# EAGLE design Adafruit ESP8266 Feather (EAGLE 6.4)
COMPANY: ADAFRUIT INDUSTRIES; DRAWN: KTOWN; REV: B
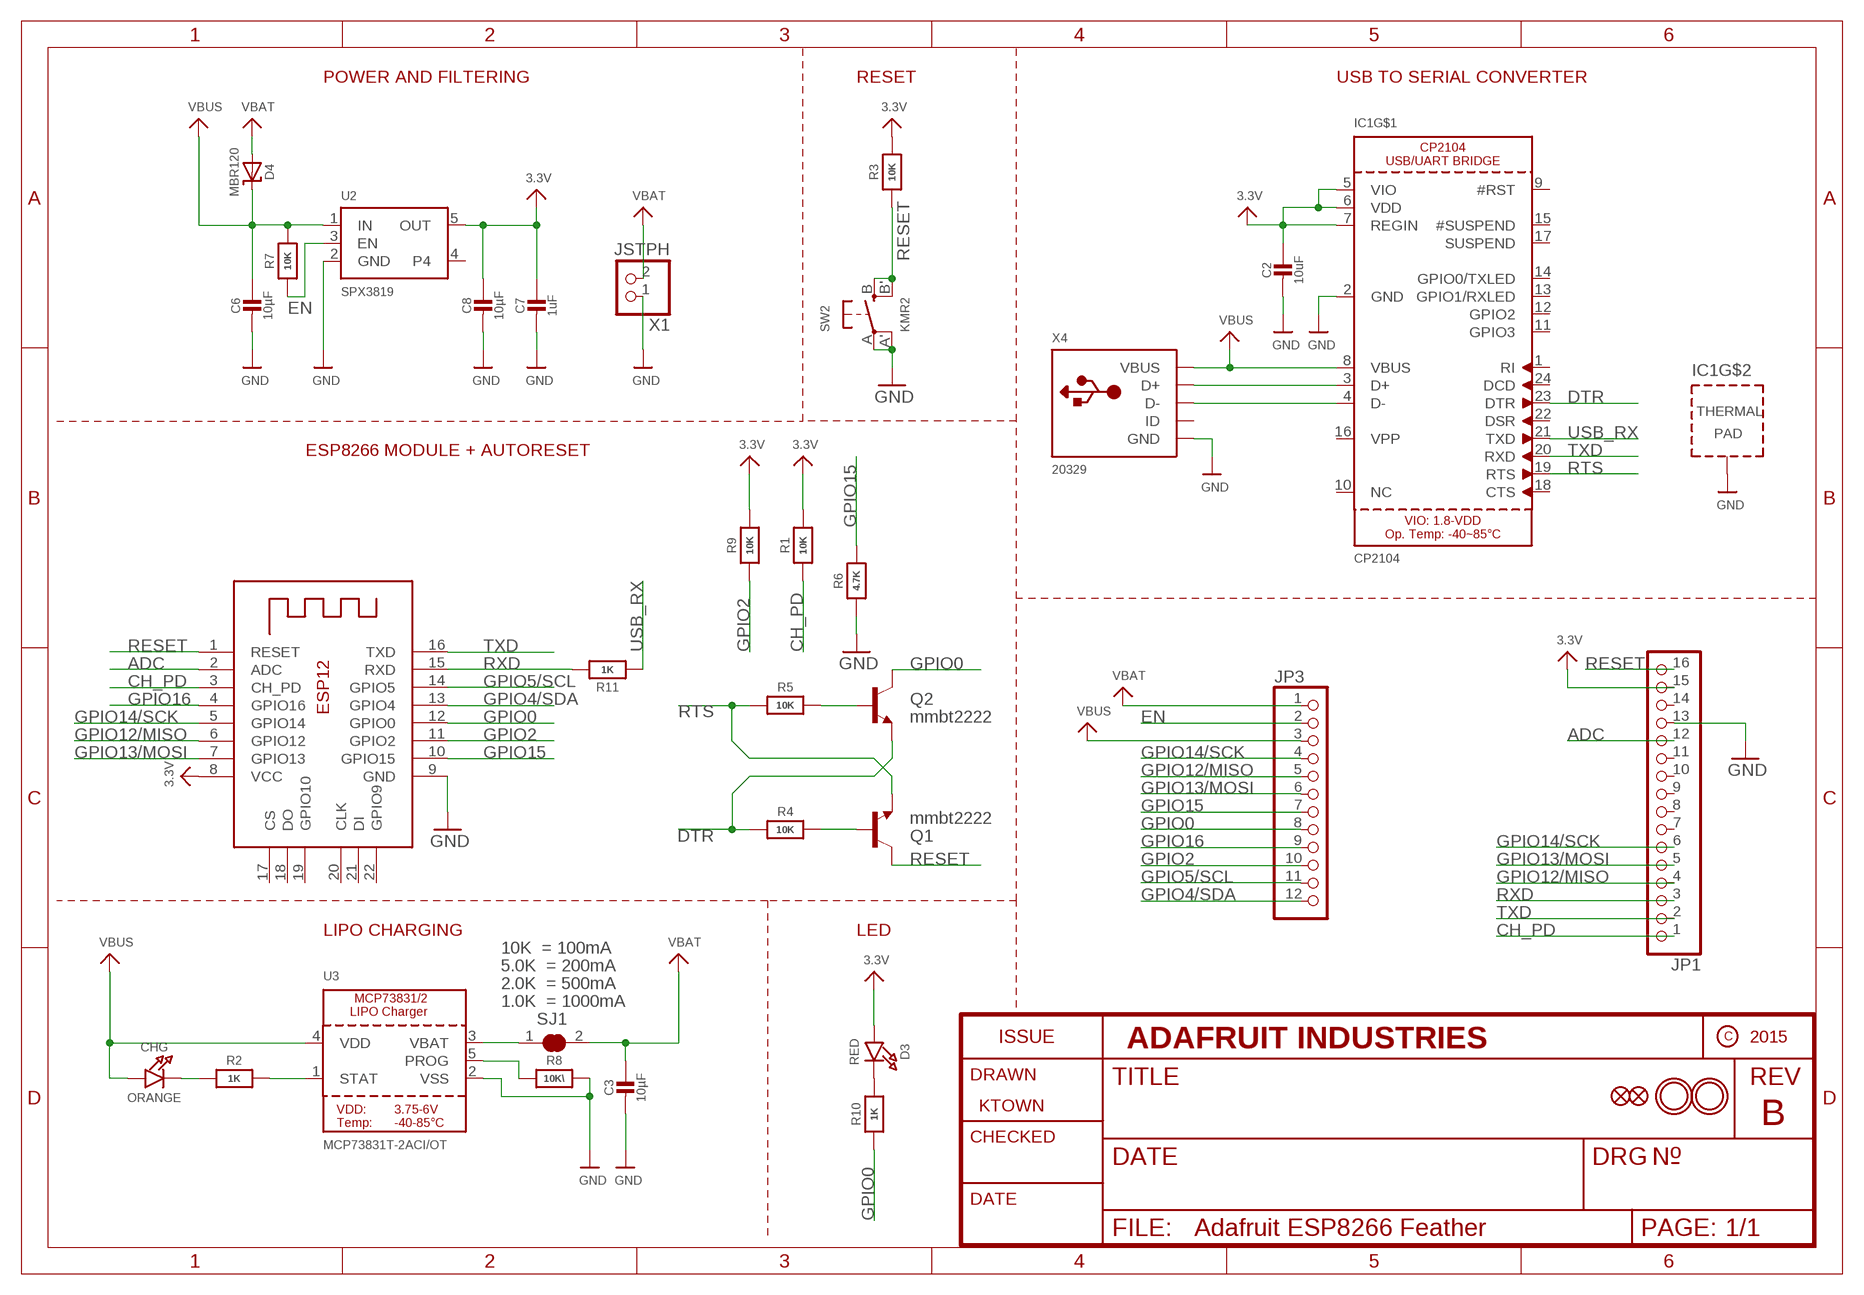
[diagram p0: schematic, sheet 1]

## Parts
C2  10uF  CAP_CERAMIC0805-NOOUTLINE  [0805-NO]
C3  10µF  CAP_CERAMIC0805-NOOUTLINE  [0805-NO]
C6  10µF  CAP_CERAMIC0805-NOOUTLINE  [0805-NO]
C7  1uF  CAP_CERAMIC0603_NO  [0603-NO]
C8  10µF  CAP_CERAMIC0805-NOOUTLINE  [0805-NO]
CHG  ORANGE  LED0805_NOOUTLINE  [CHIPLED_0805_NOOUTLINE]
D3  RED  LED0805_NOOUTLINE  [CHIPLED_0805_NOOUTLINE]
D4  MBR120  DIODE-SCHOTTKYSOD-123  [SOD-123]
IC1  CP2104  [QFN24_4MM_SMSC]
JP1  HEADER-1X16ROUND  [1X16_ROUND]
JP3  HEADER-1X12  [1X12_ROUND]
Q1  mmbt2222  TRANSISTOR_NPNSOT23-3  [SOT23-3]
Q2  mmbt2222  TRANSISTOR_NPNSOT23-3  [SOT23-3]
R1  10K  RESISTOR_0603_NOOUT  [0603-NO]
R2  1K  RESISTOR_0603_NOOUT  [0603-NO]
R3  10K  RESISTOR_0603_NOOUT  [0603-NO]
R4  10K  RESISTOR_0603_NOOUT  [0603-NO]
R5  10K  RESISTOR_0603MP  [_0603MP]
R6  4.7K  RESISTOR_0603_NOOUT  [0603-NO]
R7  10K  RESISTOR_0603_NOOUT  [0603-NO]
R8  10K\  RESISTOR_0603_NOOUT  [0603-NO]
R9  10K  RESISTOR_0603_NOOUT  [0603-NO]
R10  1K  RESISTOR_0603_NOOUT  [0603-NO]
R11  1K  RESISTOR_0603MP  [_0603MP]
SJ1  SOLDERJUMPER_CLOSED  [SOLDERJUMPER_CLOSEDWIRE]
SW2  KMR2  SWITCH_TACT_SMT4.6X2.8  [BTN_KMR2_4.6X2.8]
U2  SPX3819  VREG_SOT23-5  [SOT23-5]
U3  MCP73831T-2ACI/OT  MCP73831/2  [SOT23-5]
U$31  MOUNTINGHOLE2.5  [MOUNTINGHOLE_2.5_PLATED]
U$32  MOUNTINGHOLE2.5  [MOUNTINGHOLE_2.5_PLATED]
U$34  FIDUCIAL""  [FIDUCIAL_1MM]
U$35  FIDUCIAL""  [FIDUCIAL_1MM]
X1  JSTPH  CON_JST_PH_2PIN  [JSTPH2]
X2  ESP-12  ESP-12E  [ESP-12E]
X4  20329  USB_MICRO_20329_V2  [4UCONN_20329_V2]

## Nets
3.3V: C2.1 C7.1 C8.1 D3.A IC1.5(VIO) IC1.6(VDD) IC1.7(REGIN) JP1.15 R1.2 R3.2 R9.2 U2.5(OUT) X2.8(VCC)
ADC: JP1.12 X2.2(ADC)
CH_PD: JP1.1 R1.1 X2.3(CH_PD)
DTR: IC1.23(DTR) Q2.2(E) R4.1
EN: JP3.2 R7.1 U2.3(EN)
GND: C2.2 C3.2 C6.2 C7.2 C8.2 IC1.2(GND) IC1.THERM(TP) JP1.13 R6.1 R8.2 SW2.A'(P1) SW2.A(P) U2.2(GND) U3.2(VSS) X1.1 X2.9(GND) X4.BASE@1(GND) X4.BASE@2(GND) X4.GND X4.SPRT@1(GND) X4.SPRT@2(GND) X4.SPRT@3(GND) X4.SPRT@4(GND)
GPIO0: JP3.8 Q2.3(C) R10.1 X2.12(GPIO0)
GPIO2: JP3.10 R9.1 X2.11(GPIO2)
GPIO4/SDA: JP3.12 X2.13(GPIO4)
GPIO5/SCL: JP3.11 X2.14(GPIO5)
GPIO12/MISO: JP1.4 JP3.5 X2.6(GPIO12)
GPIO13/MOSI: JP1.5 JP3.6 X2.7(GPIO13)
GPIO14/SCK: JP1.6 JP3.4 X2.5(GPIO14)
GPIO15: JP3.7 R6.2 X2.10(GPIO15)
GPIO16: JP3.9 X2.4(GPIO16)
N$1: CHG.C R2.1
N$2: IC1.3(D+) X4.D+
N$3: R2.2 U3.1(STAT)
N$4: R8.1 U3.5(PROG)
N$5: D3.C R10.2
N$6: IC1.4(D-) X4.D-
N$7: SJ1.1 U3.3(VBAT)
N$12: Q1.1(B) R4.2
N$13: Q2.1(B) R5.2
RESET: JP1.16 Q1.3(C) R3.1 SW2.B'(S1) SW2.B(S) X2.1(RESET)
RTS: IC1.19(RTS) Q1.2(E) R5.1
RXD: JP1.3 R11.2 X2.15(RXD)
TXD: IC1.20(RXD) JP1.2 X2.16(TXD)
USB_RX: IC1.21(TXD) R11.1
VBAT: C3.1 D4.A JP3.1 SJ1.2 X1.2
VBUS: C6.1 CHG.A D4.C IC1.8(VBUS) JP3.3 R7.2 U2.1(IN) U3.4(VDD) X4.VBUS
Unconnected: IC1.1(RI) IC1.9(#RST) IC1.10(NC) IC1.11(GPIO3) IC1.12(GPIO2) IC1.13(GPIO1/RXLED) IC1.14(GPIO0/TXLED) IC1.15(#SUSPEND) IC1.16(VPP) IC1.17(SUSPEND) IC1.18(CTS) IC1.22(DSR) IC1.24(DCD) JP1.7 JP1.8 JP1.9 JP1.10 JP1.11 JP1.14 U2.4 X2.17(CS) X2.18(DO) X2.19(GPIO10) X2.20(CLK) X2.21(DI) X2.22(GPIO9) X4.ID

## Notes on the sheet
- POWER AND FILTERING | RESET | USB TO SERIAL CONVERTER
- ESP8266 MODULE + AUTORESET
- LIPO CHARGING | LED
- 10K  = 100mA
- 5.0K  = 200mA
- 2.0K  = 500mA
- 1.0K  = 1000mA

## Library data of the parts
C2 C3 C6-C8 = microbuilder:CAP_CERAMIC: Ceramic Capacitors For new designs, use the packages preceded by an '_' character since they are more reliable: The following footprints should be used on most boards: _0402 - Standard footprint for regular board layouts _0603 - Standard footprint for regular board layouts _0805 - Standard footprint for regular board layouts _1206 - Standard footprint for regular board layouts For extremely tight-pitch boards where space is at a premium, the following 'micro-pitch' footprints can be used (smaller pads, no silkscreen outline, etc.): _0402MP - Micro-pitch footprint for very dense/compact boards _0603MP - Micro-pitch footprint for very dense/compact boards _0805MP - Micro-pitch footprint for very dense/compact boards _1206MP - Micro-pitch footprint for very dense/compact boards
CHG D3 = microbuilder:LED: LED 0603 - 0603 Surface Mount Package 2mA: Green LED - Low Power (3.9mcd, 2ma, 1.7Vf) - Digikey: 475-2709-2-ND Orange LED - Low Power (9.8mcd, 2ma, 1.8Vf) - Digikey: 475-1194-2-ND Red LED - Low Power (5mcd, 2ma, 1.8Vf) - Digikey: 475-1195-2-ND Yellow LED - Low Power (7mcd, 2ma, 1.8Vf) - Digikey: 475-1196-2-ND 5mA: Blue LED - Low Power (17mcd, 5ma, 2.9Vf) - Digikey: LNJ937W8CRACT-ND 0805 - 0805 Surface Mount Package 2mA: Red LED (8.8mcd, 2mA, 1.8Vf, Clear) - Low Power [Digikey: 475-2510-1-ND] Green LED (5mcd, 2mA, 1.8Vf, Clear) - Low Power [Digikey: 475-2730-1-ND] Yellow LED (11.3mcd, 2mA, 1.8Vf, Clear) - Low Power [Digikey: 475-2555-1-ND] 20mA: Red LED (104mcd, 20mA, Diffused) - LS R976 [Digikey: 475-1278-6-ND] Red LED (12mcd, 20mA, 2.0Vf, Clear) - APT2012EC [Digikey: 754-1128-1-ND] Green LED (15mcd, 20mA, 2.2Vf, Clear) - APT2012GC [Digikey: 754-1131-1-ND] Orange LED (160mcd, 20mA, 2.1Vf, Clear) - APT2012SECK [Digikey: 754-1130-1-ND] 1206 - 1206 Surface Mount Package Green LED (26mcd, 20mA, Diffused) - LG N971 [Digikey: 475-1407-6-ND] Red LED (15mcd, 20mA, Diffused) - LH N974 [Digikey: 475-1416-6-ND] Cree - Cree High-Power Surface Mount LEDs XPEBWT-L1-0000-00D50 - White 111lm 350mA 2.9Vf 6200K 110° XTEAWT-00-0000-00000LEE3 - White 114lm 350mA 2.85Vf 5000K 115° Everlight - Everlight 45-21 Series Surface Mount LEDs 45-21/QK2C-B2832AC2CB2/2T - Warm White 2000mcd 20mA 3.25Vf 3050K 120° 45-21/LK2C-B38452C4CB2/2T - Nuetral White 2000mcd 20mA 3.25Vf 4150K 120° 45-21/LK2C-B50634C6CB2/2T - Cold White 2200mcd 20mA 3.25Vf 5650K 120° PLCC2 Reverse Mount LS T77K-J1L2-1-0-2-R18-Z - Red 11.25mcd 2mA 1.8Vf 630nm 120° LO T77K-L1M2-24-Z - Orange 19.6mcd 2mA 1.8Vf 606nm 120° LY T77K-K2M1-26-Z - Yellow 15.7mcd 2mA 1.8Vf 587nm 120°
D4 = microbuilder:DIODE-SCHOTTKY
IC1 = microbuilder:CP2104: CP2104 - USB to UART Bridge VDD Output: 3.45V
JP1 = microbuilder:HEADER-1X16: PIN HEADER
JP3 = microbuilder:HEADER-1X12
Q1 Q2 = SparkFun:TRANSISTOR_NPN: Transistor NPN BJT configuration in SOT23 package. MMBT2222 is the common NPN we use. Double check BCE configuration again layout.
R1-R11 = microbuilder:RESISTOR: Resistors For new designs, use the packages preceded by an '_' character since they are more reliable: The following footprints should be used on most boards: _0402 - Standard footprint for regular board layouts _0603 - Standard footprint for regular board layouts _0805 - Standard footprint for regular board layouts _1206 - Standard footprint for regular board layouts For extremely tight-pitch boards where space is at a premium, the following 'micro-pitch' footprints can be used (smaller pads, no silkscreen outline, etc.): _0402MP - Micro-pitch footprint for very dense/compact boards _0603MP - Micro-pitch footprint for very dense/compact boards _0805MP - Micro-pitch footprint for very dense/compact boards _1206MP - Micro-pitch footprint for very dense/compact boards
SJ1 = microbuilder:SOLDERJUMPER_CLOSED: Solder Jumper - Closed These solder jumpers are closed by default CLOSEDWIRE - 10 mil trace between pads that can be cut and resoldered later CLOSEDPERM - 63 mil trace between pads for a permanent connection (used to 'bridge' two signals, a shameless hack for Eagle). Can double as a test point as well (no cream layer)
SW2 = microbuilder:SWITCH_TACT_SMT: SMT Tact Switches 6x6mm - Digikey: P12940SCT-ND KMR2 (4.6x2.8mm) - Digikey: 401-1426-1-ND EVQ-PQHB55 - Light Touch, 160GF (4.5x4.5mm) - Digikey: P8090SCT-ND KMT0 - KMT021 NGJ LHS (etc.) IP68/Waterproof - Digikey: CKN10289CT-ND
U2 = microbuilder:VREG_SOT23-5: SOT23-5 Fixed Voltage Regulators Part Current Out V Out V In V Dropout θJA (°C/W) TJ (°C) Digikey Part No. ADP121 150mA 3.3V 3.4-5.5V 0.09V @ 150mA -- -- ADP121-AUJZ33R7CT-ND ADP121 150mA 3.0V 3.1-5.5V 0.09V @ 150mA -- -- ADP121-AUJZ30R7CT-ND ADP122 300mA 3.3V 3.4-5.5V 0.085V @ 300mA -- -- ADP122AUJZ-3.3-R7CT-ND ADP1712 300mA 3.3V 3.5-5.5V 0.17V @ 300mA -- -- ADP1712AUJZ-3.3-R7TR-ND AP7311 (Low Cost) 150mA 3.3V 3.5-6V 0.15V @ 150mA -- -- AP7311-33WG-7DICT-ND LD39015M18R 150mA 1.8V 1.9V-5.5V 0.08V @ 100mA -- -- 497-6977-1-ND LP2985A-33DBVR 150mA 3.3V 3.3-16V 0.28V @ 150mA 206 150 296-18479-1-ND MCP1824T-3302E/OT 300mA 3.3V 3.5V-6V 0.2V @ 300mA -- -- MCP1824T-3302E/OTCT-ND MIC5205-2.5YM5 TR 150mA 2.5V 2.7-16V 0.165V @ 150mA -- -- 576-1257-2-ND MIC5205-3.0YM5 TR 150mA 3.0V 3.2V-16V 0.165V @ 150mA -- -- 576-1258-2-ND MIC5205-3.3YM5 TR 150mA 3.3V 3.5V-16V 0.165V @ 150mA -- -- 576-1259-2-ND TPS780330220 150mA 3.3V+2.2V 3.6-5.5V 250mV Max -- -- 296-23332-1-ND TDA3663/N1,135 100mA 3.3V 3.5-45V 0.18V @ 50mA -- -- 568-5343-1-ND Max operating temp can be calculated using θJA, TJ (max junction temperature), and power in watts. Set the "Maximum Ambient Temperature" until it reaches TJ ("Max Junction Temperature"), which is the absolute limit for safe use of the regulator: Heat Sink Temperature Calculator <http://www.daycounter.com/Calculators/Heat-Sink-Temperature-Calculator.phtml> For example, With 12V source into a 3.3V LP2985 and a 30mA load, we are dissipating (12V-3.3V) * 0.03A = 0.261W. With a θJA of 206 °C/W, a TJ of 150°C, and 261mW we can safely use the chip without a heat sink up to 75°C (=147.1°C Junction Temperature).
U3 = microbuilder:MCP73831/2: MCP73831/2 LIPO Charger VDD: 3.75 - 6V Temp -40 - 85°C Programmable Charge Rate: 15-500mA NOTE: STAT is a tri-state logic output on the MCP73831 and an open-drain output on the MCP73832. SOT23-5 with 4.2V output and tri-state logic on STAT = MCP73831T-2ACI/OT
U$31 U$32 = microbuilder:MOUNTINGHOLE: Mounting Hole For #2 screws (0.086"/2.18mm width, 0.094"/2.4mm hole) use 2.5mm; BOM: EXCLUDE
U$34 U$35 = microbuilder:FIDUCIAL: Fiducial Alignment Points Various fiducial points for machine vision alignment.; BOM: EXCLUDE
X1 = microbuilder:CON_JST_PH_2PIN: JST 2-Pin Right-Angle Connector PH-Series - 4UConnector: 17311 SH-Series - 4UConnector: 07278
X2 = microbuilder:ESP-12E
X4 = microbuilder:USB: USB Connectors USBMINIB - Surface Mount Female Mini-B USB Connector 4UConnector: 06564

## Board
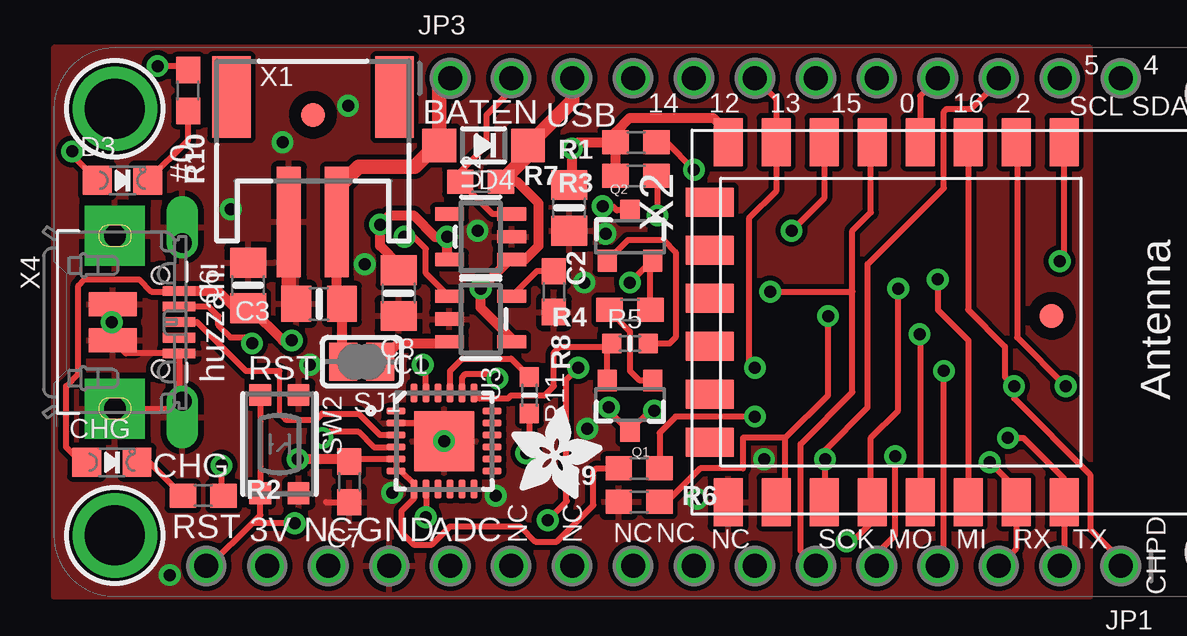
[diagram p1: board, top side]
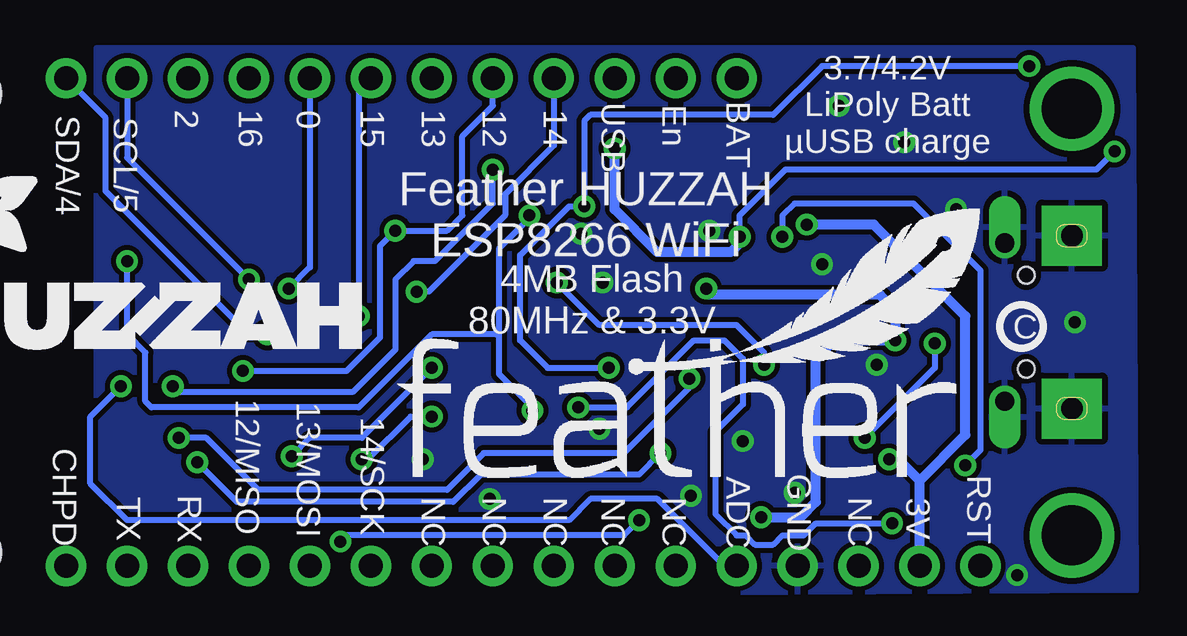
[diagram p2: board, bottom side, seen from below]

Size 1.31 x 8.1 mm. Coordinates in mm from the lower left corner, seen from the top.
Copper layers (1*16): Top 0.035mm / dielectric 1.5mm / Bottom 0.035mm
Design rules "adafruit *": minimum track width 8mil, minimum drill 15.5mil, track to track 8mil, track to pad 8mil, pad to pad 8mil, via to via 8mil, smd to smd 8mil, copper to edge 10mil, drill to drill 8mil, minimum pad ring 10mil, minimum via ring 8mil, stop-mask expansion 2mil, vias tented up to drill 20mil, thermal gap 10mil
Holes 2.2 mm at 46.37,-5.54 46.37,13.57

### Footprints (pad centres in the part's own frame; a part is rotated, then mirrored left to right if it is on the bottom)
0805-NO = smd 1.24 x 1.5: 1 -0.95,0; 2 0.95,0
0603-NO = smd 1.1 x 1: 1 -0.85,0; 2 0.85,0
CHIPLED_0805_NOOUTLINE = smd 1.2 x 1.2: A 0,-1.05; C 0,1.05
SOD-123 = smd 1.4 x 1.4: A 1.85,0; C -1.85,0
QFN24_4MM_SMSC = smd 0.8 x 0.28: 1 -2,1.25; 2 -2,0.75; 3 -2,0.25; 4 -2,-0.25; 5 -2,-0.75; 6 -2,-1.25; 13 2,-1.25; 14 2,-0.75; 15 2,-0.25; 16 2,0.25; 17 2,0.75; 18 2,1.25 | smd 0.28 x 0.8: 7 -1.25,-2; 8 -0.75,-2; 9 -0.25,-2; 10 0.25,-2; 11 0.75,-2; 12 1.25,-2; 19 1.25,2; 20 0.75,2; 21 0.25,2; 22 -0.25,2; 23 -0.75,2; 24 -1.25,2 | smd 2.5 x 2.5: THERM 0,0
1X16_ROUND = drill 1 pad 1.676: 1 -19.05,0; 2 -16.51,0; 3 -13.97,0; 4 -11.43,0; 5 -8.89,0; 6 -6.35,0; 7 -3.81,0; 8 -1.27,0; 9 1.27,0; 10 3.81,0; 11 6.35,0; 12 8.89,0; 13 11.43,0; 14 13.97,0; 15 16.51,0; 16 19.05,0
1X12_ROUND = drill 1 pad 1.676: 1 -13.97,0; 2 -11.43,0; 3 -8.89,0; 4 -6.35,0; 5 -3.81,0; 6 -1.27,0; 7 1.27,0; 8 3.81,0; 9 6.35,0; 10 8.89,0; 11 11.43,0; 12 13.97,0
SOT23-3 = smd 0.8 x 0.9: 1 -0.95,-1; 2 0.95,-1; 3 0,1.1
_0603MP = smd 0.8 x 0.8: 1 -0.762,0; 2 0.762,0
SOLDERJUMPER_CLOSEDWIRE = smd 1.168 x 1.6: 1 -0.762,0; 2 0.762,0 | smd 0.635 x 0.203: WIRE 0,0
BTN_KMR2_4.6X2.8 = smd 0.9 x 0.9: A 2.05,0.8; A' -2.05,0.8; B 2.05,-0.8; B' -2.05,-0.8
SOT23-5 = smd 0.55 x 1.2: 1 -0.95,-1.3; 2 0,-1.3; 3 0.95,-1.3; 4 0.95,1.3; 5 -0.95,1.3
MOUNTINGHOLE_2.5_PLATED = drill 2.5 pad 3.2: P$1 0,0
FIDUCIAL_1MM = smd 1 x 1: 1 0,0
JSTPH2 = smd 1 x 4.6: 1 -1,-3.7; 2 1,-3.7 | smd 1.6 x 3.4: NC1 -3.4,1.5; NC2 3.4,1.5
ESP-12E = smd 2 x 1.2: 1 -7.5,5.77; 2 -7.5,3.77; 3 -7.5,1.77; 4 -7.5,-0.23; 5 -7.5,-2.23; 6 -7.5,-4.23; 7 -7.5,-6.23; 8 -7.5,-8.23; 9 7.5,-8.23; 10 7.5,-6.23; 11 7.5,-4.23; 12 7.5,-2.23; 13 7.5,-0.23; 14 7.5,1.77; 15 7.5,3.77; 16 7.5,5.77 | smd 1.2 x 2: 17 -5,-9; 18 -3,-9; 19 -1,-9; 20 1,-9; 21 3,-9; 22 5,-9
4UCONN_20329_V2 = smd 1 x 2: BASE@1 -0.75,-2; BASE@2 0.75,-2 | smd 0.4 x 1.35: D+ 0,0.775; D- -0.65,0.775; GND 1.3,0.775; ID 0.65,0.775; VBUS -1.3,0.775 | drill 0.8 pad 1.2 offset: SPRT@1 -3.3,0.9; SPRT@2 3.3,0.9 | drill 0.9 pad 2.5 square: SPRT@3 -3.6,-1.9; SPRT@4 3.6,-1.9 | hole 0.7: -1.95,0; 1.95,0

### Placement (x,y rotation side)
C2  19.57,8.81 270 top  (outside the outline)
C3  9.16,4.81 180 top  (outside the outline)
C6  6.2,5.58 90 top  (outside the outline)
C7  10.41,-2.6 270 top  (outside the outline)
C8  12.47,5.26 270 top  (outside the outline)
CHG  0.52,-1.79 270 top
D3  0.97,9.96 270 top
D4  16.01,11.42 180 top  (outside the outline)
IC1  14.36,-0.9 0 top  (outside the outline)
JP1  23.51,-6.11 180 top  (outside the outline)
JP3  28.59,14.21 0 top  (outside the outline)
Q1  22.11,0.62 180 top  (outside the outline)
Q2  22.11,7.61 0 top  (outside the outline)
R1  22.36,11.54 180 top  (outside the outline)
R2  4.33,-3.19 0 top  (outside the outline)
R3  22.36,10.15 180 top  (outside the outline)
R4  22.11,4.56 180 top  (outside the outline)
R5  22.11,3.16 0 top  (outside the outline)
R6  22.49,-3.44 0 top  (outside the outline)
R7  15.89,9.89 0 top  (outside the outline)
R8  18.94,5.32 270 top  (outside the outline)
R9  22.49,-2.05 180 top  (outside the outline)
R10  3.7,13.7 270 top  (outside the outline)
R11  17.92,1 270 top  (outside the outline)
SJ1  10.93,2.4 180 top  (outside the outline)
SW2  7.51,-1.03 270 top  (outside the outline)
U2  15.89,7.61 90 top  (outside the outline)
U3  15.89,4.18 270 top  (outside the outline)
U$7  [ADAFRUIT_5MM]  43.76,6.53 90 bottom  (outside the outline)
U$9  [FEATHERLOGO]  28.78,-2.49 0 bottom  (outside the outline)
U$13  [PCBFEAT-REV-040]  2.74,3.86 0 bottom
U$15  [ADAFRUIT_3.5MM]  17.16,-3.32 0 top  (outside the outline)
U$23  [HUZZAHLOGO]  48.02,2.91 0 bottom  (outside the outline)
U$31  0.65,12.94 270 top  (outside the outline)
U$32  0.65,-4.84 270 top  (outside the outline)
U$34  8.9,12.69 270 top  (outside the outline)
U$35  39.68,4.31 270 top  (outside the outline)
X1  8.9,11.92 0 top  (outside the outline)
X2  34.43,4.05 270 top  (outside the outline)
X4  2.55,4.05 270 top

### Tracks (layer width: path | path; a pad name or v marks a point on that pad's centre or on a via)
3.3V  (via drill 0.5)
  Top 0.254: R1.2 21.51,11.58 | R9.2 20.71,-2.05 20.59,-2.17 20.59,-3.57 19.06,-5.09 18.17,-5.09 17.54,-4.46 14.62,-4.46 13.86,-5.22 13.09,-5.22 12.59,-4.71 12.59,-3.82 13.11,-3.3 IC1.7 13.11,-2.7 12.57,-2.15 IC1.6 IC1.5 10.64,-1.65 | 26.2,11.93 X2.8 | D3.A -1.13,11 v-1.13,11.16
  Top 0.406: R3.2 R1.2 | R1.2 21.51,11.96 22.11,12.56 25.57,12.56 26.2,11.93 | R1.2 19.95,11.54 v19.7,11.29 19.7,9.89 C2.1 | U2.5 14.59,6.78 14.49,6.88 v14.49,7.61 13.98,7.61 13.09,8.5 12.08,8.5 v11.7,8.11 11.7,7.23 12.47,6.45 C8.1 | 10.64,-1.65 10.54,-1.75 C7.1 10.32,-1.67 v8.27,-1.67
  Bottom 0.254: v-1.13,11.16 -0.37,10.4 12.59,10.4 14.49,8.5 v14.49,7.61 14.49,7.35
  Bottom 0.406: 7,-2.55 5.09,-0.65 5.09,4.3 8.9,8.11 v11.7,8.11 | JP1.15 7,-2.55 | 7,-2.55 7.89,-1.67 v8.27,-1.67 | 14.49,7.35 14.87,6.97 17.92,6.97 19.7,8.75 v19.7,11.29
ADC  (via drill 0.5)
  Top 0.254: X2.2 38.24,11.51 38.24,3.42 v40.27,1.38
  Bottom 0.254: JP1.12 15.13,-6.11 17.92,-3.32 20.71,-3.32 21.6,-4.21 40.02,-4.21 41.54,-2.68 41.54,0.11 v40.27,1.38
CH_PD  (via drill 0.5)
  Top 0.254: 23.51,11.54 R1.1 23.63,11.54 v24.78,10.4 | X2.3 36.2,4.57 37.73,3.03 37.73,1.76 v38.11,1.38 38.11,0.88 41.29,-2.3 41.29,-4.59 42.56,-5.86 JP1.1
  Bottom 0.254: v24.78,10.4 24.78,9 27.19,6.59 28.08,6.59 28.84,5.83 28.84,2.91 30.62,1.13 37.86,1.13 v38.11,1.38
DTR  (via drill 0.5)
  Top 0.254: R4.1 22.96,6.61 Q2.2 23.02,6.61 v22.11,5.7 | IC1.23 13.6,1.11 13.6,2.15 v13.47,2.27
  Bottom 0.254: v13.47,2.27 13.47,2.78 14.62,3.92 20.33,3.92 v22.11,5.7
EN
  Top 0.254: JP3.2 17.16,13.7 16.14,12.69 16.14,11.42 15.04,10.31 R7.1 16.37,8.56 U2.3
GND  (via drill 0.5)
  Top 0.254: -0.3,7.65 X4.SPRT@3 | X4.BASE@2 1.1,2.75 X4.GND 3.33,0.88 X4.SPRT@2 3.15,0.45 X4.SPRT@4 | IC1.2 14.11,-0.15 14.11,-0.65 IC1.THERM | 9.44,-3.46 C7.2 | 11.95,4.05 12.33,4.05
  Top 0.406: C8.2 12.47,4.19 12.33,4.05
  Top 0.61: C3.2 7.9,5.12 X1.1
  other vias: 0.52,4.05 11.06,6.46 21.09,7.73 10.36,13.07 8.78,2.27 14.36,-0.9 16.52,-3.19 20.33,-0.39 24.9,-3.32 2.93,-6.49 5.47,8.75 7.63,11.54 12.2,-3.06 20.21,5.7 15.76,7.86 27.7,-1.67
  pour Top: -1.89,15.48 -1.89,-7.38 41.29,-7.38 41.29,15.48
  pour Bottom: -2.02,-7.13 41.29,-7.38 41.29,15.48 -1.89,15.48
GPIO0  (via drill 0.5)
  Top 0.254: Q2.3 21.56,8.71 21.39,8.88 v20.97,8.88 | v19.95,2.15 19.44,1.64 19.44,-3.37 19.48,-3.4 v18.68,-4.21 | R10.1 3.53,14.72 v2.43,14.72 | v31.13,-5.09 31.13,-5.35 32.2,-4.28 X2.12 32.14,-3.39 32.14,-0.78 33.29,0.37 v33.29,5.45
  Bottom 0.254: v2.43,14.72 11.06,14.72 13.09,12.69 20.71,12.69 20.97,12.43 v20.97,8.88 21.6,8.88 23.63,6.84 23.63,3.29 22.49,2.15 v19.95,2.15 | v18.68,-4.21 19.32,-4.84 30.87,-4.84 v31.13,-5.09 | JP3.8 32.4,6.34 v33.29,5.45
GPIO2  (via drill 0.5)
  Top 0.254: R9.1 23.34,-0.56 24.02,0.11 v27.32,0.11 | JP3.10 37.48,14.08 36.33,12.94 35.32,12.94 35.19,12.81 35.19,9.64 32.02,6.46 32.02,0.49 30.24,-1.28 v30.24,-1.67 30.24,-3.41 X2.11
  Bottom 0.254: v30.24,-1.67 29.98,-1.67 28.21,0.11 v27.32,0.11
GPIO4/SDA  (via drill 0.5)
  Top 0.254: X2.13 34.2,3.52 v34.18,3.54
  Bottom 0.254: v34.18,3.54 34.94,3.54 40.91,9.51 40.91,12.56 JP3.12
GPIO5/SCL  (via drill 0.5)
  Top 0.254: v34.94,5.83 34.94,4.56 36.21,3.29 X2.14
  Bottom 0.254: JP3.11 40.02,10.91 v34.94,5.83
GPIO12/MISO  (via drill 0.5)
  Top 0.254: X2.6 30.2,9.22 v28.84,7.86 | JP1.4 35.19,-5.86 v35.19,2.02
  Bottom 0.254: JP3.5 24.78,13.07 26.05,11.8 26.05,8.5 26.68,7.86 v28.84,7.86 29.48,7.23 29.48,3.42 30.87,2.02 v35.19,2.02
GPIO13/MOSI  (via drill 0.5)
  Top 0.254: JP1.5 32.4,-5.6 33.16,-4.84 v33.16,-1.54 | JP3.6 28.2,13.33 X2.7 28.2,9.5 27.06,8.37 27.06,2.4 v27.32,2.15
  Bottom 0.254: v27.32,2.15 30.24,-0.78 32.4,-0.78 v33.16,-1.54
GPIO14/SCK  (via drill 0.5)
  Top 0.254: 31.38,5.32 31.38,7.86 32.14,8.62 32.14,11.49 X2.5 | v27.95,5.32 31.38,5.32 | JP1.6 29.22,-5.47 29.22,-1.03 31.38,1.13 31.38,5.32
  Bottom 0.254: JP3.4 22.24,11.42 24.27,9.38 24.27,8.5 27.44,5.32 v27.95,5.32
GPIO15  (via drill 0.5)
  Top 0.254: R6.2 23.63,-3.44 25.03,-2.05 26.81,-2.05 26.81,-0.78 28.59,-0.78 | 28.59,-0.78 28.59,-3.06 X2.10 | 28.59,-0.78 30.37,1 v30.37,4.3
  Bottom 0.254: JP3.7 30.37,13.7 v30.37,4.3
GPIO16
  Top 0.254: JP3.9 34.2,13.47 X2.4
N$1
  Top 0.254: CHG.C 2.08,-1.79 R2.1
N$2
  Top 0.203: 7.51,2.02 7.51,0.24
  Top 0.254: IC1.3 11.7,-0.65 10.81,0.24 9.28,0.24 9.03,-0.01 7.76,-0.01 7.51,0.24 | X4.D+ 4.08,4.05 6.11,2.02 7.51,2.02
N$3  (via drill 0.5)
  Top 0.254: v12.71,7.61 13.09,7.61 13.6,7.1 13.6,6.08 14.56,5.13 U3.1 | R2.2 5.09,-3.1 v5.09,-1.92
  Bottom 0.254: v5.09,-1.92 4.46,-1.28 4.46,6.21 7.25,9 12.2,9 12.71,8.5 v12.71,7.61
N$4
  Top 0.254: R8.1 18.23,6.17 U3.5
N$5
  Top 0.254: D3.C 3.7,11.64 R10.2
N$6  (via drill 0.5)
  Top 0.254: IC1.4 11.44,-1.15 10.81,-0.52 9.54,-0.52 v9.28,-0.78 | X4.D- 4.57,4.7 4.97,4.3 4.97,3.92 5.47,3.42 6.11,3.42 v6.36,3.16
  Bottom 0.254: v6.36,3.16 6.36,2.15 v9.28,-0.78
N$7
  Top 0.406: SJ1.1 12.46,3.16 14.52,3.16 U3.3
N$12
  Top 0.254: R4.2 21.26,4.52 22.11,3.67 22.11,2.02 22.49,1.64 23.04,1.64 Q1.1
N$13
  Top 0.254: R5.2 23.76,3.16 24.02,3.42 24.02,6.97 23.51,7.48 22.03,7.48 Q2.1
RESET  (via drill 0.5)
  Top 0.254: JP1.16 4.58,-6.11 6.36,-4.33 | SW2.B' SW2.B 6.71,-3.99 6.36,-4.33 | v8.14,-4.33 6.36,-4.33 | R3.1 23.25,10.11 v23.25,8.5 | v21.22,0.49 21.22,0.37 22.07,-0.48 Q1.3 22.96,0.37 v23.13,0.37 | v40.02,6.59 40.2,6.77 X2.1
  Bottom 0.254: 24.52,3.67 24.52,7.1 23.25,8.37 v23.25,8.5 | 24.52,3.67 24.52,1.89 23.13,0.49 v23.13,0.37 | v21.22,0.49 19.19,0.49 16.4,3.29 15.13,3.29 14.36,2.53 14.36,0.62 15.51,-0.52 15.51,-3.95 14.62,-4.84 14.24,-4.84 13.86,-5.22 13.09,-5.22 12.71,-4.84 11.82,-4.84 11.32,-4.33 v8.14,-4.33 | 24.52,3.67 24.65,3.54 27.32,3.54 30.37,0.49 39,0.49 39.26,0.75 39.26,2.78 40.02,3.54 v40.02,6.59
RTS
  Top 0.254: IC1.19 15.84,0.88 17.03,0.88 17.16,1 18.55,1 18.94,1.38 18.94,2.78 19.19,3.03 21.22,3.03 | Q1.2 21.16,2.97 21.22,3.03 | 21.22,3.03 R5.1
RXD  (via drill 0.5)
  Top 0.254: JP1.3 38.2,-5.39 X2.15 38.2,-2.89 v37.1,-1.79 | R11.2 17.92,-1.28 v17.79,-1.41
  Bottom 0.254: v17.79,-1.41 18.68,-2.3 25.29,-2.3 26.43,-3.44 35.45,-3.44 v37.1,-1.79
TXD  (via drill 0.5)
  Top 0.254: IC1.20 15.11,1.75 15.25,1.89 16.4,1.89 v16.59,1.7 | JP1.2 40.2,-5.93 X2.16 40.2,-2.48 38.49,-0.78 v37.86,-0.78
  Bottom 0.254: v37.86,-0.78 36.72,-0.78 34.56,-2.93 26.68,-2.93 25.16,-1.41 19.32,-1.41 16.59,1.32 v16.59,1.7
USB_RX
  Top 0.254: IC1.21 14.61,2.01 15.13,2.53 17.16,2.53 R11.1
VBAT
  Top 0.254: 9.79,8.88 10.05,8.62
  Top 0.406: 10.05,8.62 10.05,8.37 X1.2 9.9,5.02 C3.1 10.11,2.47 SJ1.2 | 9.79,9.51 9.79,8.88
  Top 0.61: 9.79,9.51 10.81,10.53 13.15,10.53 14.04,11.42 D4.A 14.16,13.76 JP3.1
VBUS  (via drill 0.5)
  Top 0.254: CHG.A -0.75,-1.79 -1.38,-1.16 -1.38,1.38 -0.88,1.89 -0.88,5.57 -0.62,5.83 1.66,5.83 2.17,5.32 3.3,5.32 X4.VBUS | IC1.8 13.61,-4.09 v13.6,-4.08
  Top 0.406: X4.VBUS 4.94,5.35 5.66,4.63 C6.1 6.29,4.63 7.63,3.29 v8.01,3.29 | R7.2 17.41,9.89 18.3,9 18.3,7.23 17.73,6.66 U2.1 17.1,6.66 v15.89,5.45 15.89,4.65 17.19,3.35 U3.4
  Top 0.61: R7.2 17.86,11.02 D4.C 19.7,13.25 JP3.3
  Bottom 0.254: 15.89,5.19 v15.89,5.45
  Bottom 0.406: v13.6,-4.08 11.95,-4.08 11.32,-3.44 11.32,2.53 10.55,3.29 v8.01,3.29 8.01,4.56 8.65,5.19 15.89,5.19

### Text on the board
tPlace: 5 | 4 | 14 | 12 | 13 | 15 | 0 | 16 | 2 | BAT | EN | USB | SCL | SDA | #0 | huzzah! | RST | CHG | RST | 3V | NC | GND | ADC | NC | NC | NC | NC | NC | SCK | MO | MI | RX | TX | CHPD
bPlace: 3.7/4.2V / LiPoly Batt / µUSB charge | En | 0 | 2 | BAT | USB | 14 | 12 | 13 | 15 | 16 | SCL/5 | SDA/4 | Feather HUZZAH / ESP8266 WiFi | 4MB Flash / 80MHz & 3.3V | 14/SCK | 13/MOSI | 12/MISO | RST | CHPD | 3V | NC | GND | ADC | NC | NC | NC | NC | NC | RX | TX